# EAGLE schematic xc9536xl-bout (EAGLE 9.3.0)
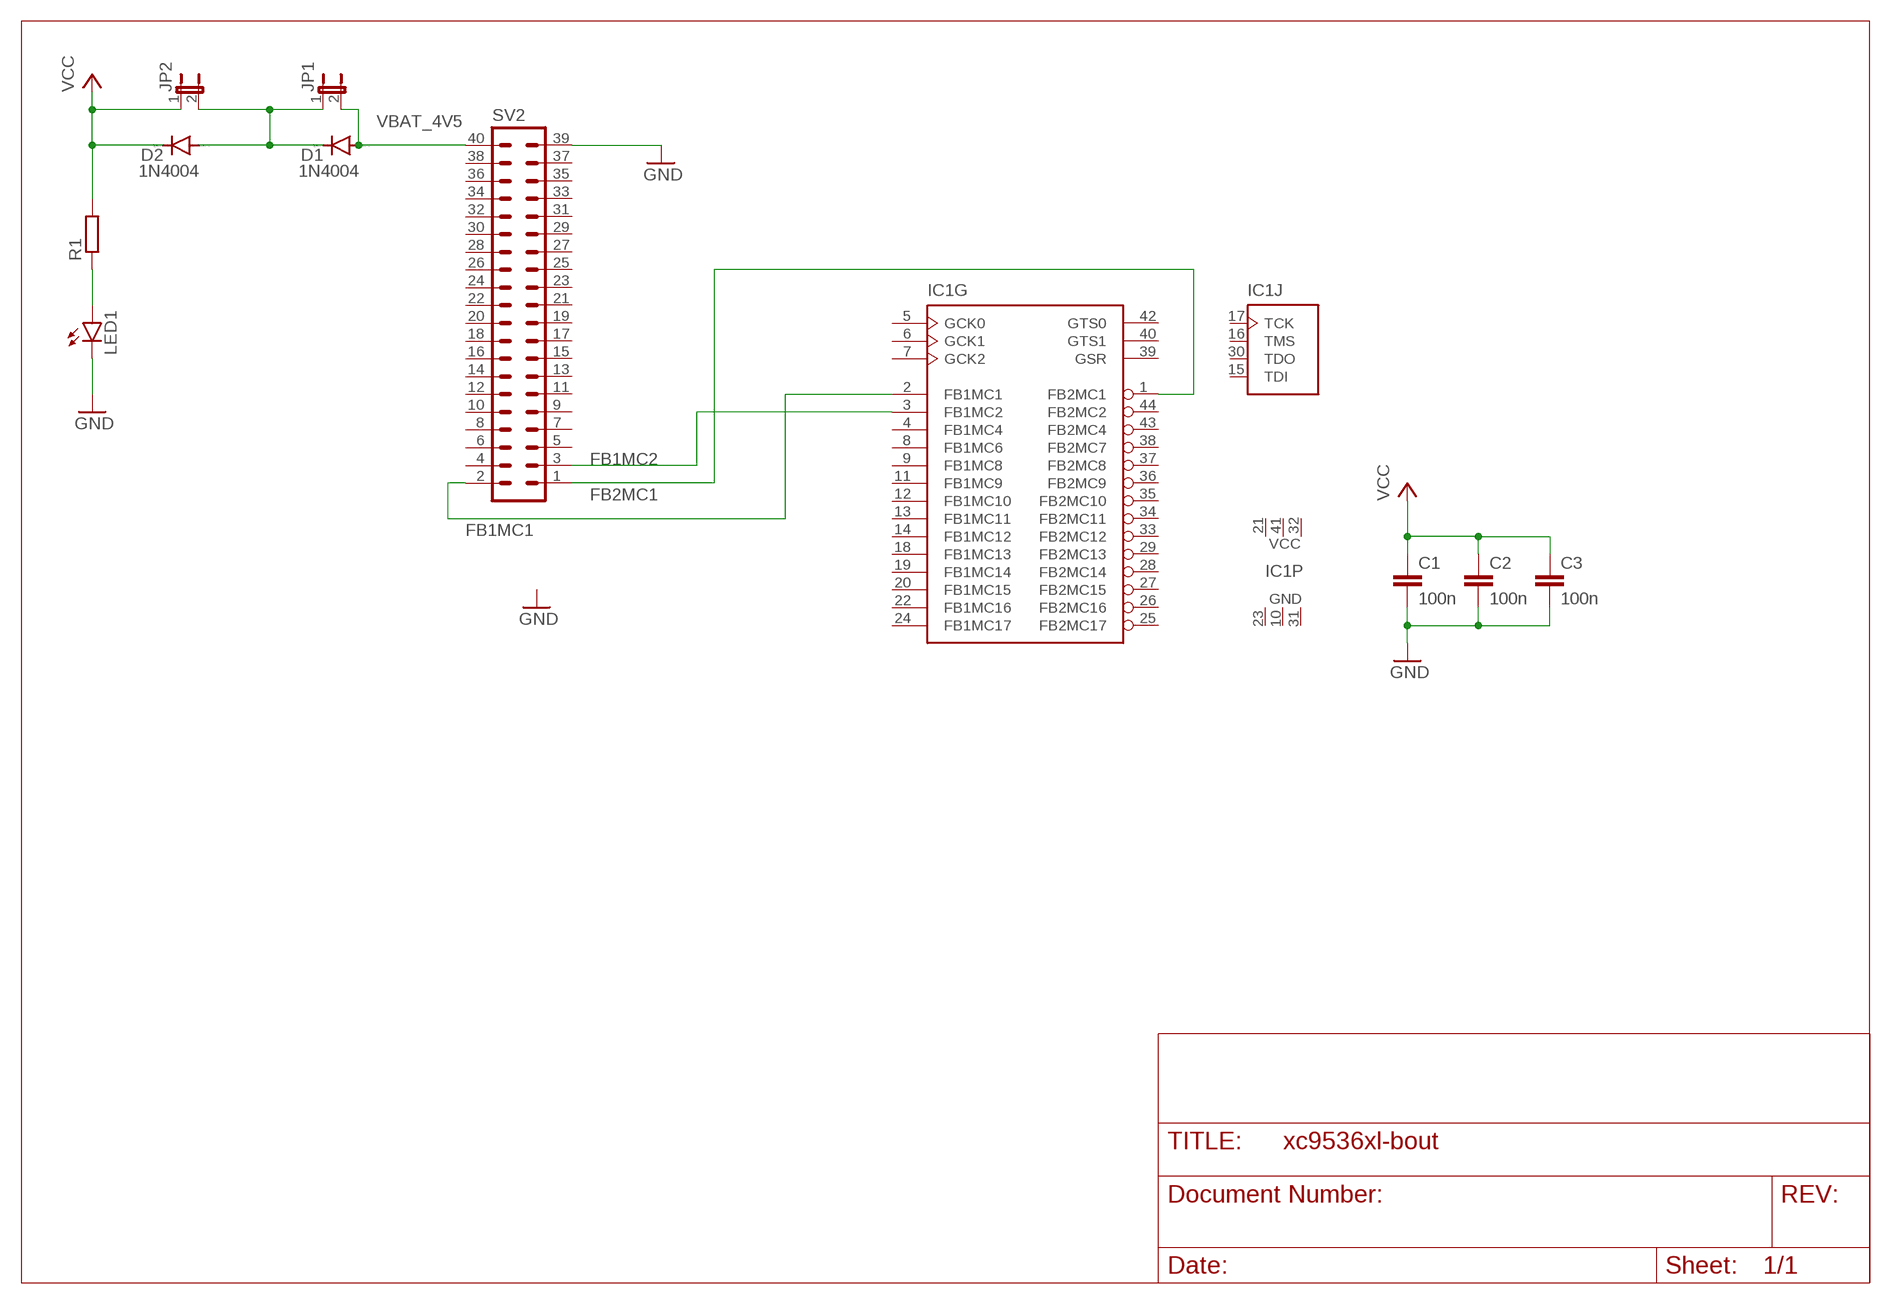
[diagram p0: schematic, sheet 1]

## Parts
C1  100n  C-EU050-025X075  [C050-025X075]
C2  100n  C-EU050-025X075  [C050-025X075]
C3  100n  C-EU050-025X075  [C050-025X075]
D1  1N4004  [DO41-10]
D2  1N4004  [DO41-10]
IC1  XC9536-44  [PLCC-S44]
JP1  JP1E  [JP1]
JP2  JP1E  [JP1]
LED1  LED5MM  [LED5MM]
R1  R-EU_0207/10  [0207/10]
SV2  ML40  [ML40]

## Nets
FB1MC1: IC1.2(G:FB1MC1) SV2.2
FB1MC2: IC1.3(G:FB1MC2) SV2.3
FB2MC1: IC1.1(G:FB2MC1) SV2.1
GND: C1.2 C2.2 C3.2 LED1.K(C) SV2.39
N$1: D1.C D2.A JP1.1 JP2.2
N$2: LED1.A R1.1
VBAT_4V5: D1.A JP1.2 SV2.40
VCC: C1.1 C2.1 C3.1 D2.C JP2.1 R1.2
Unconnected: IC1.4(G:FB1MC4) IC1.5(G:GCK0) IC1.6(G:GCK1) IC1.7(G:GCK2) IC1.8(G:FB1MC6) IC1.9(G:FB1MC8) IC1.11(G:FB1MC9) IC1.12(G:FB1MC10) IC1.13(G:FB1MC11) IC1.14(G:FB1MC12) IC1.15(J:TDI) IC1.16(J:TMS) IC1.17(J:TCK) IC1.18(G:FB1MC13) IC1.19(G:FB1MC14) IC1.20(G:FB1MC15) IC1.22(G:FB1MC16) IC1.24(G:FB1MC17) IC1.25(G:FB2MC17) IC1.26(G:FB2MC16) IC1.27(G:FB2MC15) IC1.28(G:FB2MC14) IC1.29(G:FB2MC13) IC1.30(J:TDO) IC1.33(G:FB2MC12) IC1.34(G:FB2MC11) IC1.35(G:FB2MC10) IC1.36(G:FB2MC9) IC1.37(G:FB2MC8) IC1.38(G:FB2MC7) IC1.39(G:GSR) IC1.40(G:GTS1) IC1.42(G:GTS0) IC1.43(G:FB2MC4) IC1.44(G:FB2MC2) SV2.4 SV2.5 SV2.6 SV2.7 SV2.8 SV2.9 SV2.10 SV2.11 SV2.12 SV2.13 SV2.14 SV2.15 SV2.16 SV2.17 SV2.18 SV2.19 SV2.20 SV2.21 SV2.22 SV2.23 SV2.24 SV2.25 SV2.26 SV2.27 SV2.28 SV2.29 SV2.30 SV2.31 SV2.32 SV2.33 SV2.34 SV2.35 SV2.36 SV2.37 SV2.38

## Power pins joined to a net without a drawn wire
GND: IC1.10(P:GND) IC1.23(P:GND) IC1.31(P:GND)
VCC: IC1.21(P:VCC) IC1.32(P:VCC) IC1.41(P:VCC)

## Library data of the parts
C1-C3 = rcl:C-EU: CAPACITOR, European symbol; SPICEPREFIX: C
D1 D2 = diode:1N4004: DIODE general purpose rectifier, 1 A
IC1 = XILINX:XC9536-44
JP1 JP2 = jumper:JP1E: JUMPER
LED1 = led:LED: LED OSRAM: - CHIPLED LG R971, LG N971, LY N971, LG Q971, LY Q971, LO R971, LY R971 LH N974, LH R974 LS Q976, LO Q976, LY Q976 LO Q996 - Hyper CHIPLED LW Q18S LB Q993, LB Q99A, LB R99A - SideLED LS A670, LO A670, LY A670, LG A670, LP A670 LB A673, LV A673, LT A673, LW A673 LH A674 LY A675 LS A676, LA A676, LO A676, LY A676, LW A676 LS A679, LY A679, LG A679 - Hyper Micro SIDELED® LS Y876, LA Y876, LO Y876, LY Y876 LT Y87S - SmartLED LW L88C, LW L88S LB L89C, LB L89S, LG L890 LS L89K, LO L89K, LY L89K LS L896, LA L896, LO L896, LY L896 - TOPLED LS T670, LO T670, LY T670, LG T670, LP T670 LSG T670, LSP T670, LSY T670, LOP T670, LYG T670 LG T671, LOG T671, LSG T671 LB T673, LV T673, LT T673, LW T673 LH T674 LS T676, LA T676, LO T676, LY T676, LB T676, LH T676, LSB T676, LW T676 LB T67C, LV T67C, LT T67C, LS T67K, LO T67K, LY T67K, LW E67C LS E67B, LA E67B, LO E67B, LY E67B, LB E67C, LV E67C, LT E67C LW T67C LS T679, LY T679, LG T679 LS T770, LO T770, LY T770, LG T770, LP T770 LB T773, LV T773, LT T773, LW T773 LH T774 LS E675, LA E675, LY E675, LS T675 LS T776, LA T776, LO T776, LY T776, LB T776 LHGB T686 LT T68C, LB T68C - Hyper Mini TOPLED® LB M676 - Mini TOPLED Santana® LG M470 LS M47K, LO M47K, LY M47K Source: http://www.osram.convergy.de LUXEON: - LUMILED® LXK2-PW12-R00, LXK2-PW12-S00, LXK2-PW14-U00, LXK2-PW14-V00 LXK2-PM12-R00, LXK2-PM12-S00, LXK2-PM14-U00 LXK2-PE12-Q00, LXK2-PE12-R00, LXK2-PE12-S00, LXK2-PE14-T00, LXK2-PE14-U00 LXK2-PB12-K00, LXK2-PB12-L00, LXK2-PB12-M00, LXK2-PB14-N00, LXK2-PB14-P00, LXK2-PB14-Q00 LXK2-PR12-L00, LXK2-PR12-M00, LXK2-PR14-Q00, LXK2-PR14-R00 LXK2-PD12-Q00, LXK2-PD12-R00, LXK2-PD12-S00 LXK2-PH12-R00, LXK2-PH12-S00 LXK2-PL12-P00, LXK2-PL12-Q00, LXK2-PL12-R00 Source: www.luxeon.com KINGBRIGHT: KA-3528ASYC Source: www.kingbright.com
R1 = rcl:R-EU_: RESISTOR, European symbol; SPICEPREFIX: R
SV2 = con-harting-ml:ML40: HARTING; OC_FARNELL: unknown; OC_NEWARK: unknown